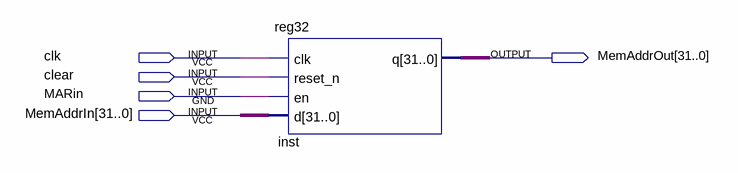
[diagram p0: schematic sheet]
// Quartus schematic mar_design.bdf as structural Verilog: 1 symbols, 5 pins
module mar_design (
  input  clk,
  input  clear,
  input  MARin,
  input  [31:0] MemAddrIn,
  output [31:0] MemAddrOut
);

  reg32 inst (.clk(clk), .reset_n(clear), .en(MARin), .d(MemAddrIn), .q(MemAddrOut));
endmodule
